# EAGLE design RTS_Hub_V1.2 (EAGLE 9.5.2)
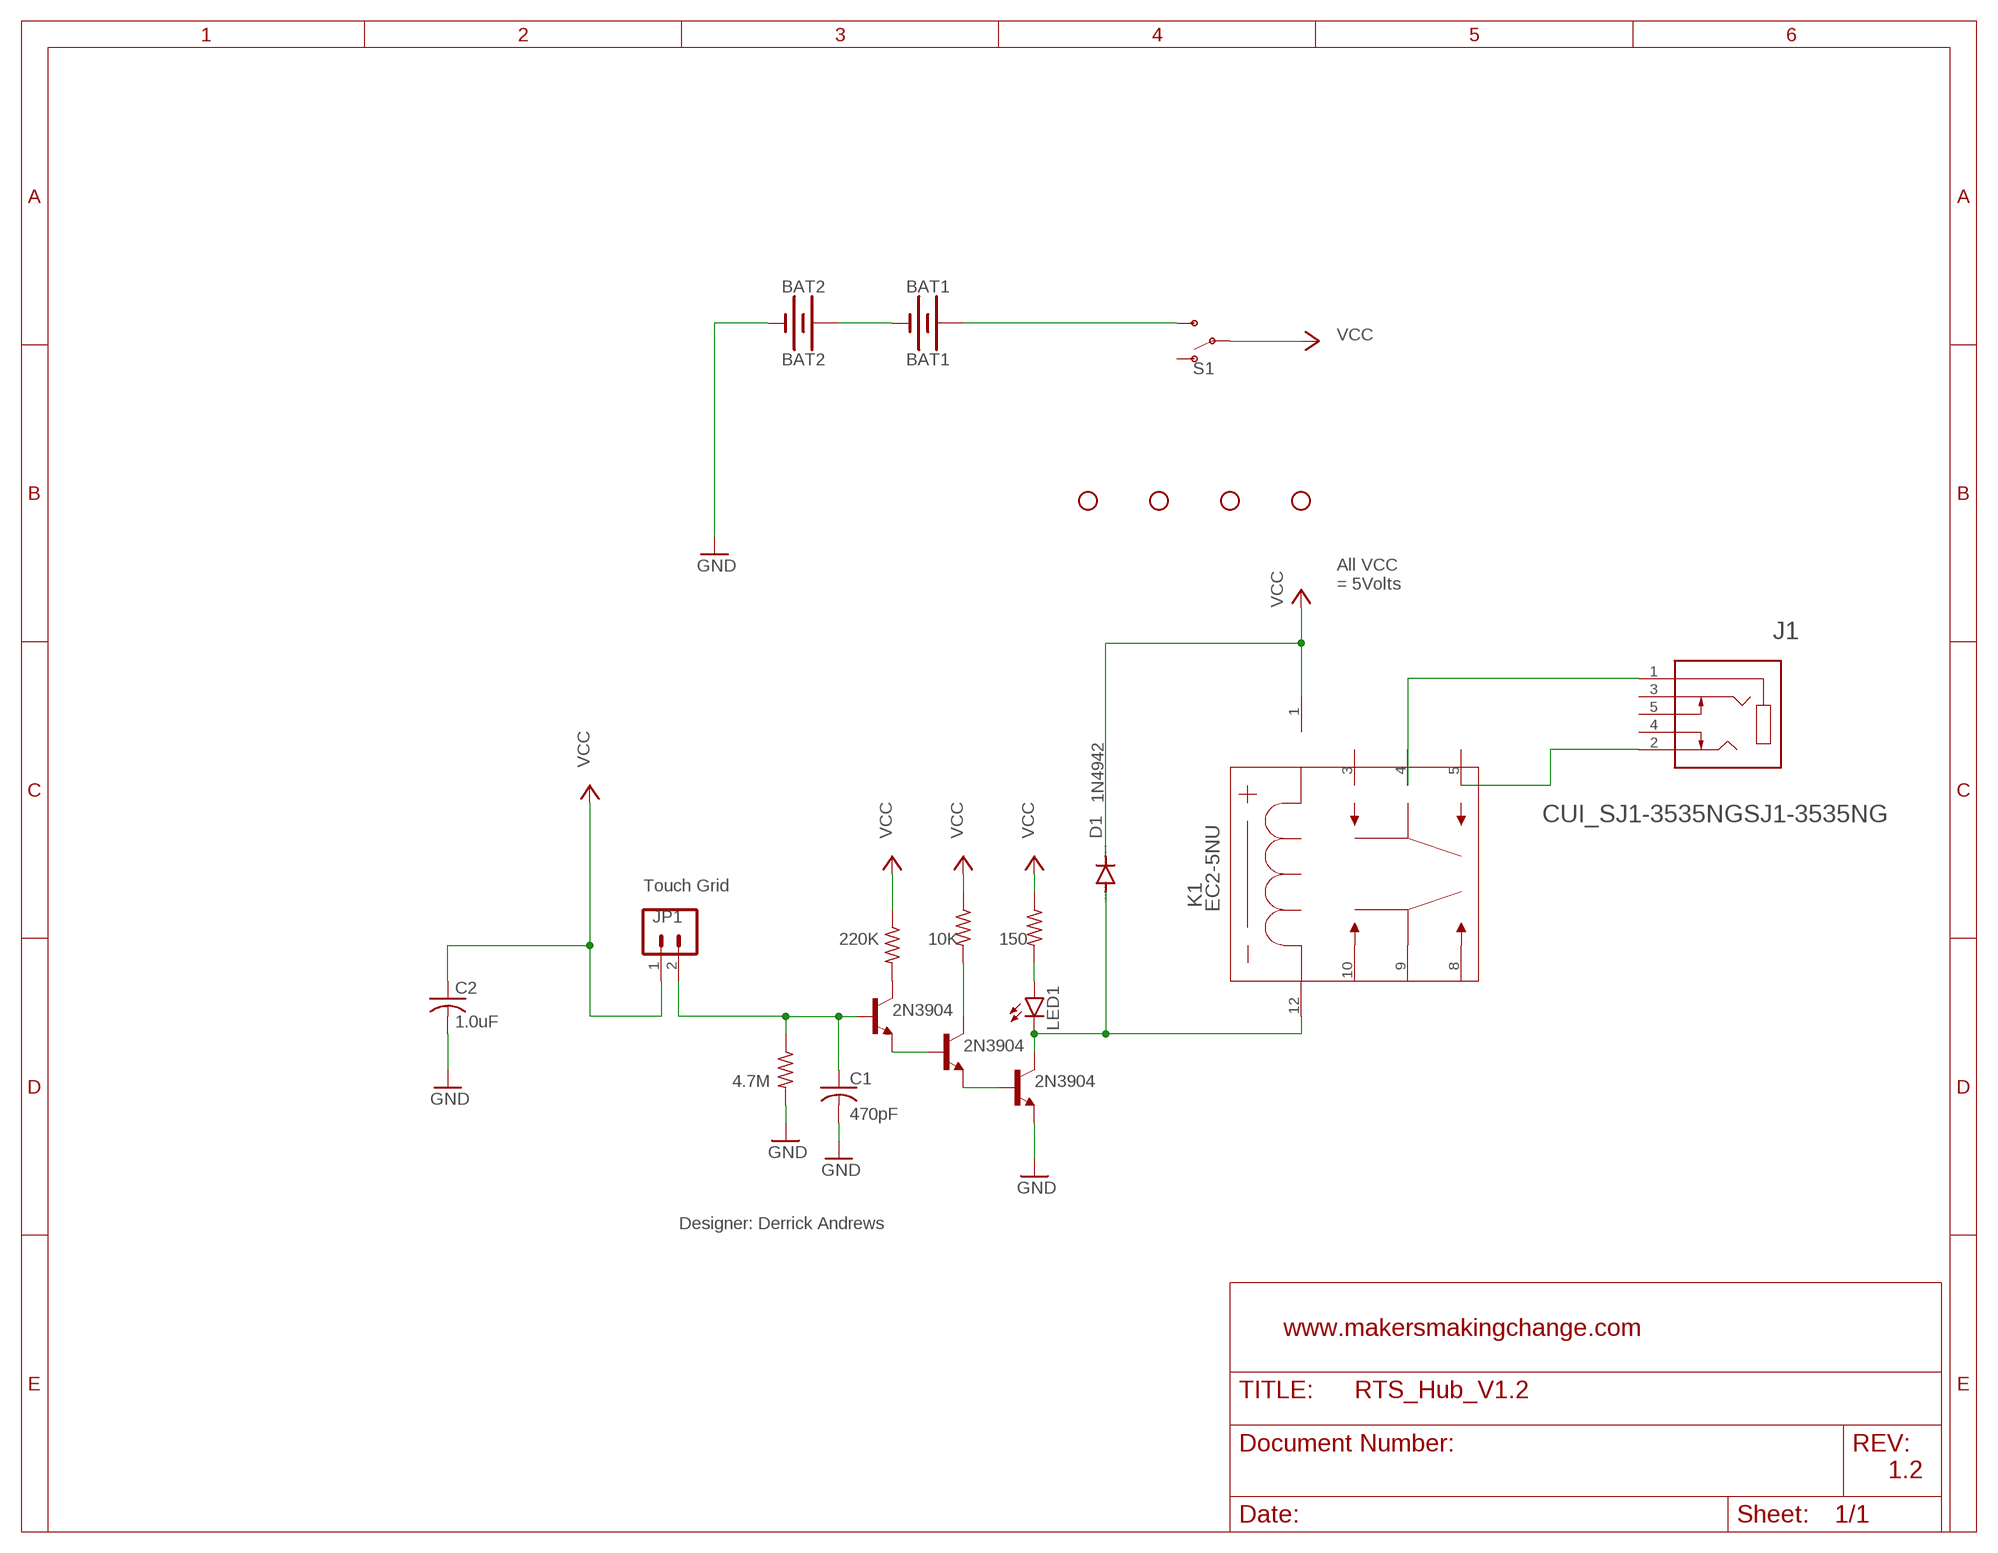
[diagram p0: schematic, sheet 1]

## Parts
BAT1  BAT1  BATTERY-20MM_PTH  [BATTCOM_20MM_PTH]
BAT2  BAT2  BATTERY-20MM_PTH  [BATTCOM_20MM_PTH]
C1  470pF  CAPACITOR-US-025  [C025-030X050]
C2  1.0uF  CAPACITOR-US-050  [C050-030X075]
D1  1N4942  DIODE-DO41  [DO41-10]
H1  STAND-OFF-  [STAND-OFF]
H2  STAND-OFF-  [STAND-OFF]
H3  STAND-OFF-  [STAND-OFF]
H4  STAND-OFF-  [STAND-OFF]
J1  CUI_SJ1-3535NGSJ1-3535NG  [CUI_SJ1-3535NG]
JP1  HEADER_1X02-1X02  [1X02]
K1  EC2-5NU  [EC2NU]
LED1  LED5MM  [LED_5MM]
R1  10K  RESISTOR-US-0207/7  [RESISTOR_0207/7]
R2  4.7M  RESISTOR-US-0207/7  [RESISTOR_0207/7]
R3  220K  RESISTOR-US-0207/7  [RESISTOR_0207/7]
R4  150  RESISTOR-US-0207/7  [RESISTOR_0207/7]
S1  SWITCH-SPDT-PTH_11.6X4.0MM  [SWITCH_SPDT_PTH_11.6X4.0MM]
T1  2N3904  [TO92-CBE]
T2  2N3904  [TO92-CBE]
T3  2N3904  [TO92-CBE]

## Nets
GND: BAT2.- C1.2 C2.2 R2.2 T1.E
N$1: T2.B T3.E
N$2: T1.B T2.E
N$3: D1.A K1.12 LED1.K(C) T1.C
N$4: R1.2 T2.C
N$5: R3.2 T3.C
N$6: LED1.A R4.2
N$7: C1.1 JP1.2 R2.1 T3.B
N$9: BAT1.+ S1.3(S)
N$11: J1.1 K1.4
N$12: J1.2 K1.5
N$15: BAT1.- BAT2.+
VCC: C2.1 D1.C JP1.1 K1.1 R1.1 R3.1 R4.1 S1.2(P)
Unconnected: J1.3 J1.4 J1.5 K1.3 K1.8 K1.9 K1.10 S1.1(O)

## Notes on the sheet
- All VCC
  = 5Volts
- Touch Grid
- 220K | 10K | 150
- 4.7M
- Designer: Derrick Andrews
- www.makersmakingchange.com
- 1.2

## Library data of the parts
BAT1 BAT2 = MMC Eagle:BATTERY-
C1 C2 = MMC Eagle:CAPACITOR-US-
D1 = MMC Eagle:DIODE-: DIODE 1.0 A, 200 V, 150 ns
H1-H4 = MMC Eagle:STAND-OFF-
J1 = MMC Eagle:CUI_SJ1-3535NG
JP1 = MMC Eagle:HEADER_1X02-
K1 = MMC Eagle:EC2-5NU; MANUFACTURER_PART_NUMBER: EC25NU; VENDOR: KEMET
LED1 = MMC Eagle:LED: LED (Generic) Standard schematic elements and footprints for 5mm, 3mm, 1206, and 0603 sized LEDs. Generic LEDs with no color specified.
R1-R4 = MMC Eagle:RESISTOR-US-: RESISTOR, American symbol
S1 = MMC Eagle:SWITCH-SPDT-
T1-T3 = MMC Eagle:2N3904

## Board
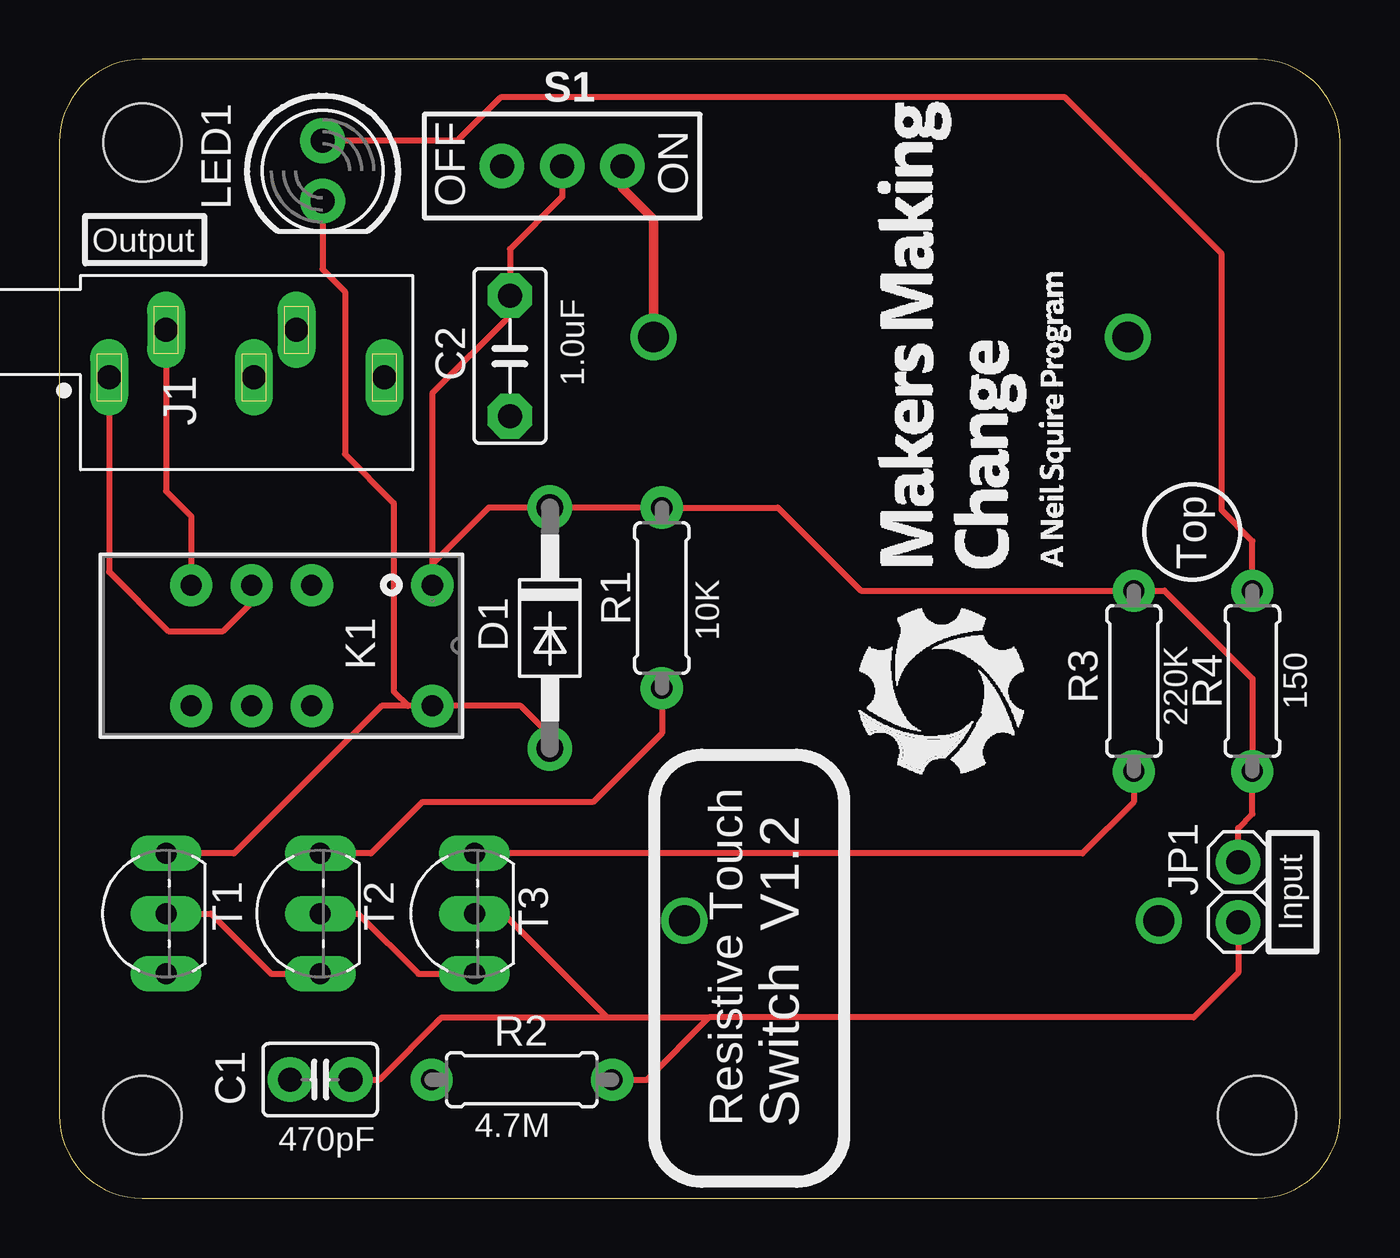
[diagram p1: board, top side]
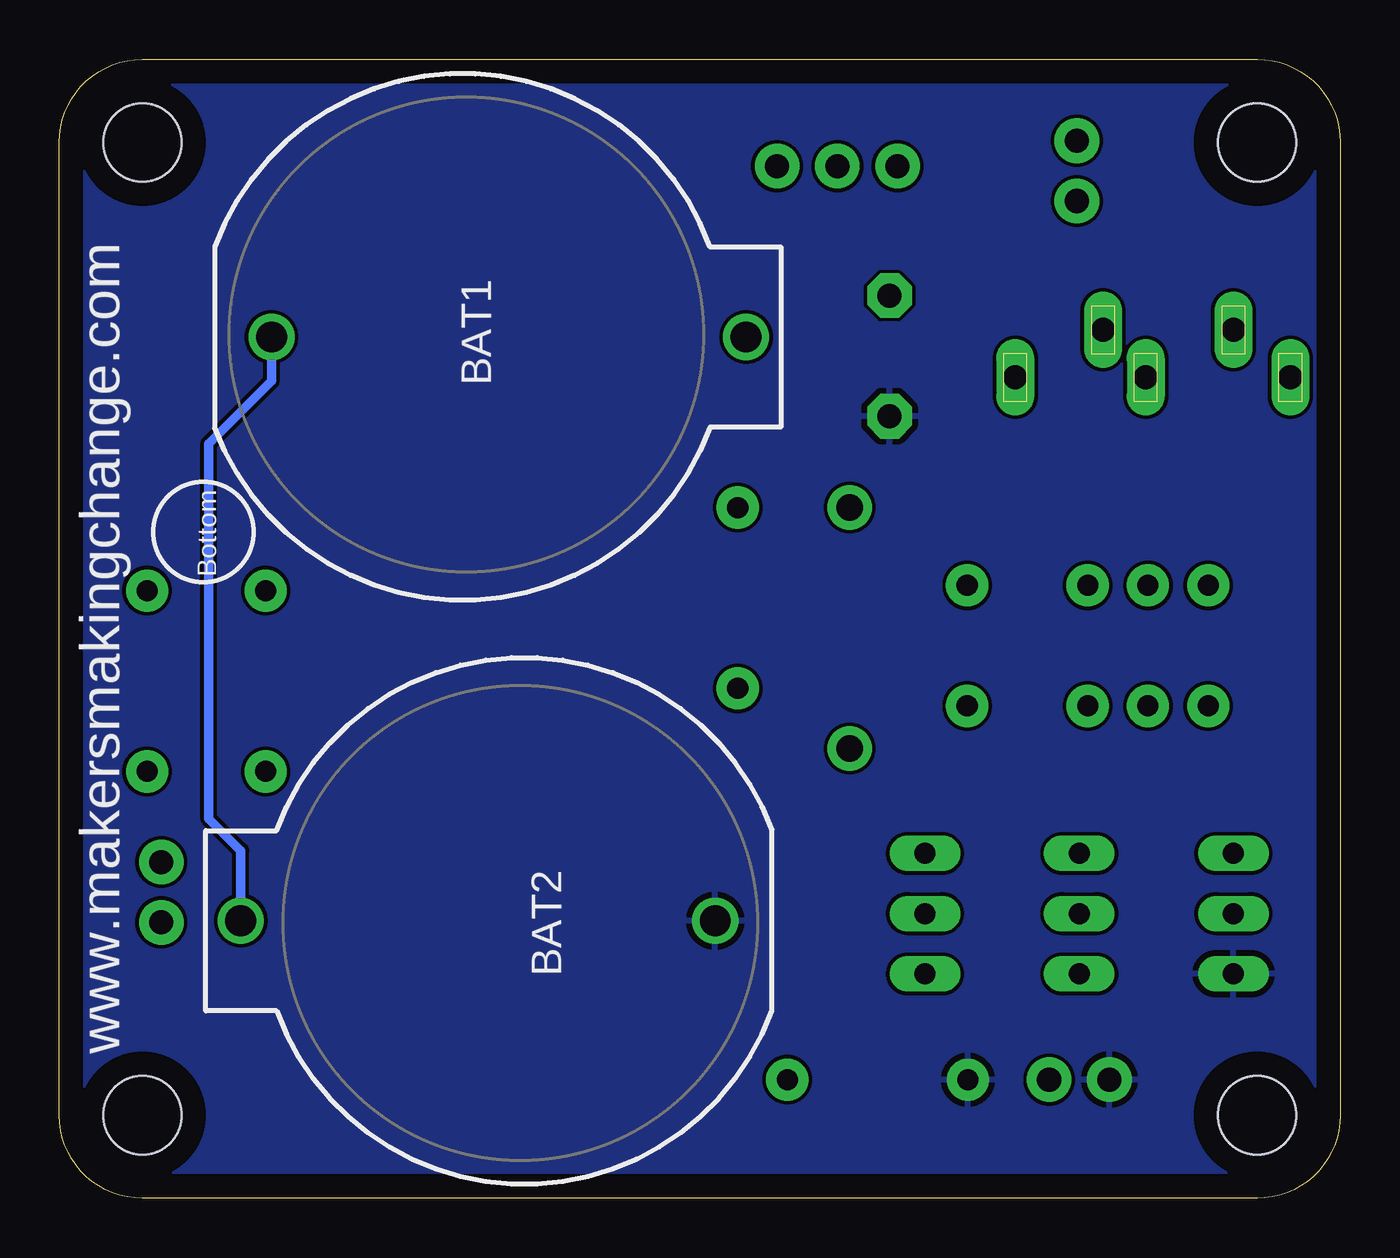
[diagram p2: board, bottom side, seen from below]

Size 54 x 48 mm. Coordinates in mm from the lower left corner, seen from the top.
Outline: 0,3.5 arc90 3.5,0 50.5,0 arc90 54,3.5 54,44.5 arc90 50.5,48 3.5,48 arc90 0,44.5 0,3.5
Copper layers (1*16): Top 0.035mm / dielectric 1.5mm / Bottom 0.035mm
Design rules "default *": minimum track width 6mil, minimum drill 10mil, track to track 6mil, track to pad 10mil, pad to pad 6mil, via to via 6mil, smd to smd 6mil, copper to edge 40mil, drill to drill 10mil, minimum pad ring 12mil, minimum via ring 10mil, stop-mask expansion 4mil, vias tented up to drill 0mil, thermal gap 10mil

### Footprints (pad centres in the part's own frame; a part is rotated, then mirrored left to right if it is on the bottom)
BATTCOM_20MM_PTH = drill 1.3: + 11.85,0; - -8.15,0
C025-030X050 = drill 1.016 pad 1.88: 1 -1.27,0; 2 1.27,0
C050-030X075 = drill 1.016 pad 1.88 octagon: 1 -2.54,0; 2 2.54,0
DO41-10 = drill 1.118 pad 1.88: A 5.08,0; C -5.08,0
STAND-OFF = hole 3.302: 0,0
CUI_SJ1-3535NG = drill 1 long: 1 0,0; 2 2.4,2; 3 7.9,2; 4 11.6,0; 5 6.1,0
1X02 = drill 1.016 pad 1.88: 1 -1.27,0; 2 1.27,0
EC2NU = drill 0.889 pad 1.778: 1 -5.08,12.725; 3 -5.08,7.645; 4 -5.08,5.105; 5 -5.08,2.565; 8 0,2.565; 9 0,5.105; 10 0,7.645; 12 0,12.725
LED_5MM = drill 1.016 pad 1.88: A -1.27,0; K 1.27,0
RESISTOR_0207/7 = drill 0.889 pad 1.778: 1 -3.81,0; 2 3.81,0
SWITCH_SPDT_PTH_11.6X4.0MM = drill 1.016 pad 1.88: 1 0,2.54; 2 0,0; 3 0,-2.54
TO92-CBE = drill 0.889 long: B 0,0; C 2.54,0; E -2.54,0

### Placement (x,y rotation side)
BAT1  36.9,36.3 0 bottom
BAT2  34.5,11.7 180 bottom
C1  11,5 180 top
C2  19,35.5 270 top
D1  20.68,24.03 270 top
H1  3.5,3.5 0 top
H2  3.5,44.5 0 top
H3  50.5,44.5 0 top
H4  50.5,3.5 0 top
J1  2.1,34.6 0 top
JP1  49.7,12.9 270 top
K1  3,20.75 270 top
LED1  11.1,43.3 270 top
R1  25.4,25.3 270 top
R2  19.5,5 180 top
R3  45.3,21.8 270 top
R4  50.3,21.8 90 top
S1  21.2,43.5 90 top
T1  4.5,12 90 top
T2  11,12 90 top
T3  17.5,12 90 top

### Tracks (layer width: path | path; a pad name or v marks a point on that pad's centre or on a via)
GND
  pour Bottom: 0,0 0,48 54,48 54,0
N$1
  Top 0.254: T2.B 12.6,12 15.14,9.46 T3.E
N$2
  Top 0.254: T1.B 6.4,12 8.94,9.46 T2.E
N$3
  Top 0.254: LED1.K 11.1,39.15 12.04,38.21 12.04,31.36 14.1,29.3 14.1,21.35 14.7,20.75 | T1.C 7.37,14.54 13.58,20.75 14.7,20.75 | 14.7,20.75 K1.12 19.45,20.75 20.68,19.52 D1.A
N$4
  Top 0.254: T2.C 13.14,14.54 15.3,16.7 22.5,16.7 25.4,19.6 R1.2
N$5
  Top 0.254: R3.2 45.3,16.7 43.14,14.54 T3.C
N$6
  Top 0.254: LED1.A 16.77,44.57 18.6,46.4 42.4,46.4 49,39.8 49,29 50.3,27.7 R4.2
N$7
  Top 0.254: R2.1 24.78,5 27.4,7.62 | C1.1 13.5,5 16.12,7.62 23.1,7.62 | 23.1,7.62 27.4,7.62 | T3.B 18.72,12 23.1,7.62 | JP1.2 49.7,9.5 47.82,7.62 27.4,7.62
N$9
  Top 0.406: S1.3 23.74,42.56 25.05,41.25 BAT1.+
N$11
  Top 0.254: J1.1 2.1,26.4 4.6,23.9 6.9,23.9 8.11,25.11 K1.4
N$12
  Top 0.254: J1.2 4.5,29.8 5.57,28.73 K1.5
N$15
  Bottom 0.406: BAT2.+ 46.35,14.65 47.7,16 47.7,31.8 45.05,34.45 BAT1.-
VCC
  Top 0.254: JP1.1 49.7,15.6 50.3,16.2 R4.1 50.3,21.9 46.59,25.61 R3.1 33.79,25.61 30.29,29.11 R1.1 D1.C 18.11,29.11 15.72,26.73 | K1.1 15.72,26.73 | 15.72,26.73 15.72,33.92 19,37.2 19,38 C2.1 19,40 21.2,42.2 S1.2

### Text on the board
tPlace: OFF | ON | Output | Input | Resistive Touch | Switch V1.2
bPlace: www.makersmakingchange.com | Bottom
tNames: Top